# Altium schematic sheet CSWrite3.0.1 V0.51.SchDoc
size 609 x 431 mm; PageSetup: Record=PageOptions|CenterHorizontal=True|CenterVertical=True|PrintScale=0.38|XCorrection=1.00|YCorrection=1.00|PrintKind=2|BorderSize=5000000|LeftOffset=0|BottomOffset=0|Orientation=2|PaperLength=1000|PaperWidth=1000|Scale=100|PaperSource=7|PrintQuality=-4|MediaType=1|DitherType=10|PaperKind=A4|PrintScaleMode=1
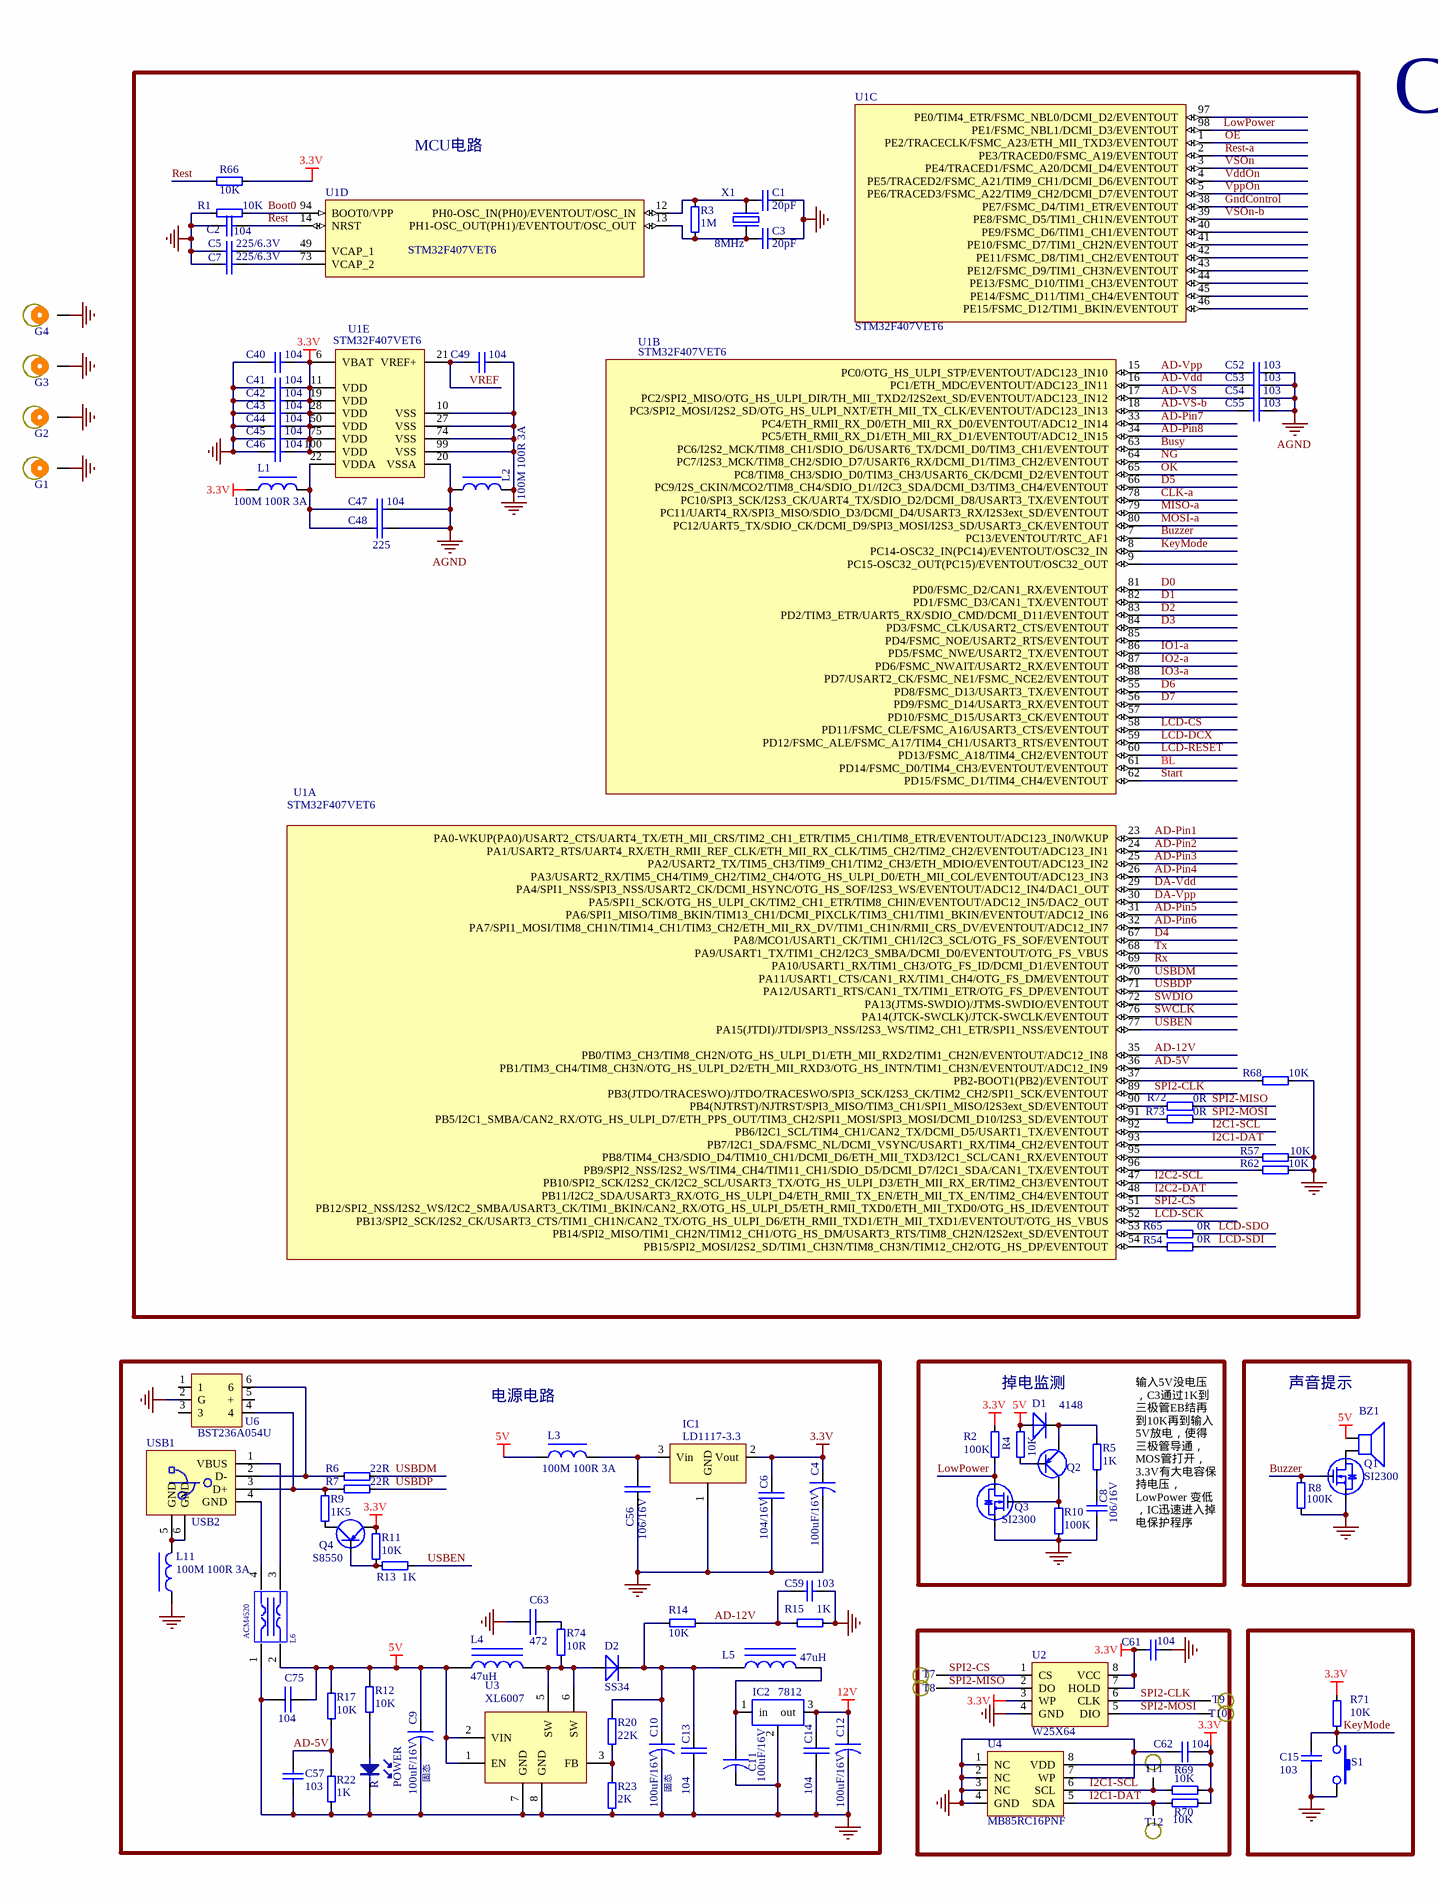
[diagram p0: CSWrite3.0.1 V0.51.SchDoc, left]
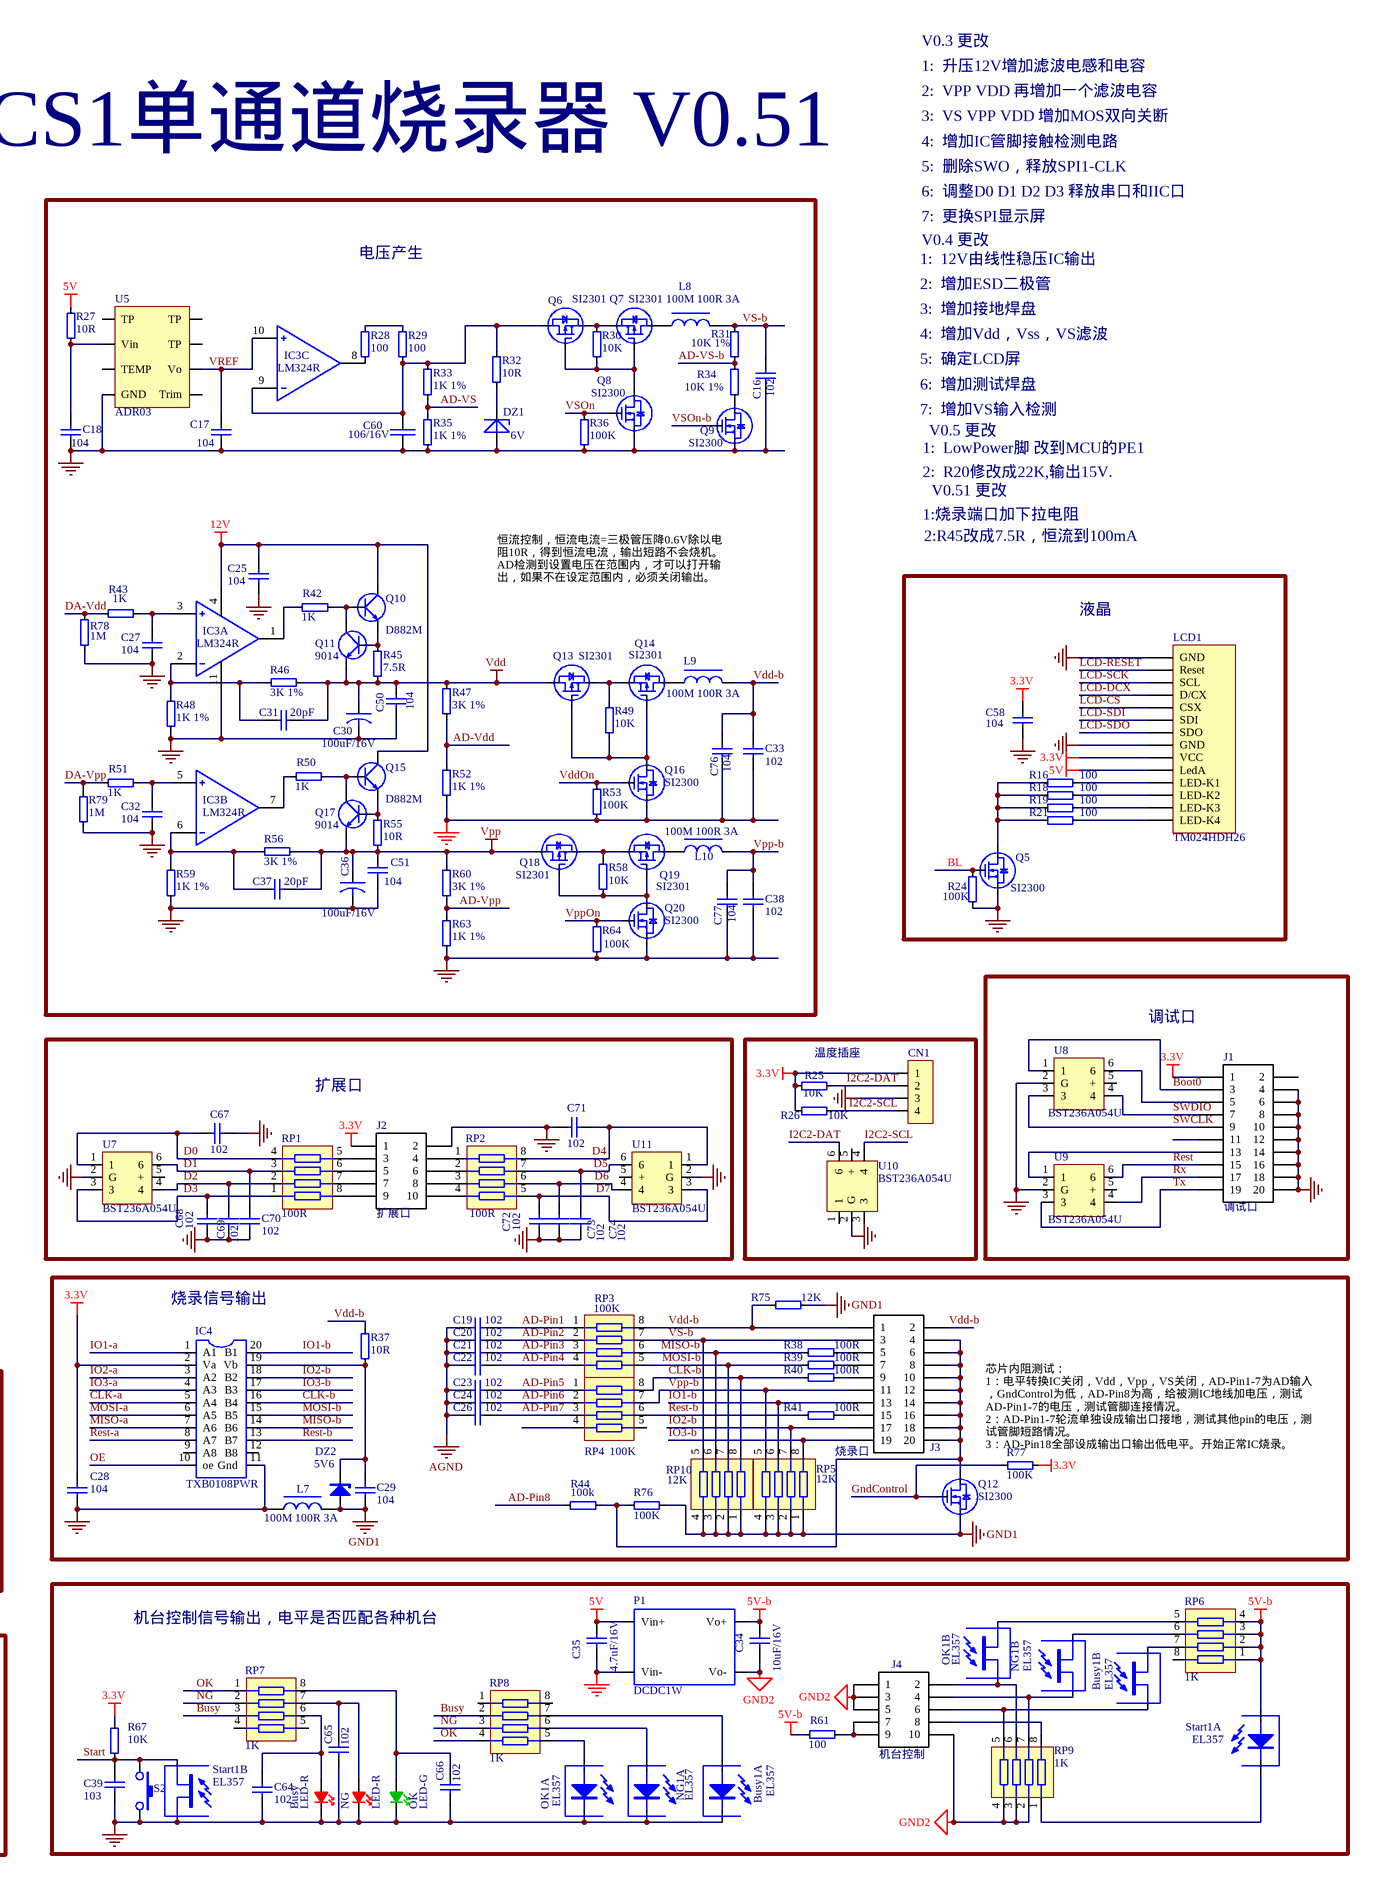
[diagram p1: CSWrite3.0.1 V0.51.SchDoc, right]

## Parts
Busy  LED-R  [LED05]
Busy1  EL357  [SOP-4]  (parts A,B of 2)
BZ1  BUZZER  [FMQ-9*5.5]  (value not drawn)
C1  20pF  [0603C]
C2  104  [0603C]
C3  20pF  [0603C]
C4  100uF/16V  [CAP-B]
C5  225/6.3V  [0603C]
C6  104/16V  [0603C]
C7  225/6.3V  [0603C]
C8  106/16V  [0603C]
C9  100uF/16V  [CB_8*11D5]
C10  100uF/16V  [CB_8*11D5]
C11  100uF/16V  [CB_8*11D5]
C12  100uF/16V  [CB_8*11D5]
C13  104  [0603C]
C14  104  [0603C]
C15  103  [0603C]
C16  102  [0603C]
C17  104  [0603C]
C18  104  [0603C]
C19  102  [0603C]
C20  102  [0603C]
C21  102  [0603C]
C22  102  [0603C]
C23  102  [0603C]
C24  102  [0603C]
C25  104  [0603C]
C26  102  [0603C]
C27  104  [0603C]
C28  104  [0603C]
C29  104  [0603C]
C30  100uF/16V  [CAP-B]
C31  20pF  [0603C]
C32  104  [0603C]
C33  102  [0603C]
C34  10uF/16V  [0603C]
C35  4.7uF/16V  [0603C]
C36  100uF/16V  [CAP-B]
C37  20pF  [0603C]
C38  102  [0603C]
C39  103  [0603C]
C40  104  [0603C]
C41  104  [0603C]
C42  104  [0603C]
C43  104  [0603C]
C44  104  [0603C]
C45  104  [0603C]
C46  104  [0603C]
C47  104  [0603C]
C48  225  [0603C]
C49  104  [0603C]
C50  104  [0603C]
C51  104  [0603C]
C52  103  [0603C]
C53  103  [0603C]
C54  103  [0603C]
C55  103  [0603C]
C56  106/16V  [0603C]
C57  103  [0603C]
C58  104  [0603C]
C59  103  [0603C]
C60  106/16V  [0603C]
C61  104  [0603C]
C62  104  [0603C]
C63  472  [0603C]
C64  102  [0603C]
C65  102  [0603C]
C66  102  [0603C]
C67  102  [0603C]
C68  102  [0603C]
C69  102  [0603C]
C70  102  [0603C]
C71  102  [0603C]
C72  102  [0603C]
C73  102  [0603C]
C74  102  [0603C]
C75  104  [0603C]
C76  104  [0603C]
C77  104  [0603C]
CN1  温度插座  [PH4AW_2D0]
D1  4148  [D1206]
D2  SS34  [D-SMA]
DZ1  6V  [D1206]
DZ2  5V6  [D1206]
G1  GND  [P1]  (value not drawn)
G2  GND  [P1]  (value not drawn)
G3  GND  [P1]  (value not drawn)
G4  GND  [P1]  (value not drawn)
IC1  LD1117-3.3  [SOT223]
IC2  7812  [TO252AA]
IC3  LM324R  [SOP14]  (parts A,B,C of 4)
IC4  TXB0108PWR  [TSSOP20]
J1  调试口  [DC_20P_W]
J2  扩展口  [IDC10-GZ]
J3  烧录口  [IDC20]
J4  机台控制
L1  100M 100R 3A  [0603]
L2  100M 100R 3A  [0603]
L3  100M 100R 3A  [0603]
L4  47uH  [L-SMD6.8*6.8]
L5  47uH  [L-SMD6.8*6.8]
L6  ACM4520  [L_6*7]
L7  100M 100R 3A  [0603]
L8  100M 100R 3A  [0603]
L9  100M 100R 3A  [0603]
L10  100M 100R 3A  [0603]
L11  100M 100R 3A  [0603]
LCD1  TM024HDH26  [TM024HDH26-V02]
NG  LED-R  [LED05]
NG1  EL357  [SOP-4]  (parts A,B of 2)
OK  LED-G  [LED05]
OK1  EL357  [SOP-4]  (parts A,B of 2)
P1  DCDC1W  [1WDC_DC-4]
POWER  R  [LED05]
Q1  SI2300  [SOT-23]
Q2  S8550  [SOT-23]  (value not drawn)
Q3  SI2300  [SOT-23]
Q4  S8550  [SOT23]
Q5  SI2300  [SOT-23]
Q6  SI2301  [SOT23]
Q7  SI2301  [SOT23]
Q8  SI2300  [SOT-23]
Q9  SI2300  [SOT-23]
Q10  D882M  [TO252AA]
Q11  9014  [SOT-23]
Q12  SI2300  [SOT-23]
Q13  SI2301  [SOT23]
Q14  SI2301  [SOT23]
Q15  D882M  [TO252AA]
Q16  SI2300  [SOT-23]
Q17  9014  [SOT-23]
Q18  SI2301  [SOT23]
Q19  SI2301  [SOT23]
Q20  SI2300  [SOT-23]
R1  10K  [0603]
R2  100K  [0603]
R3  1M  [0603]
R4  10K  [0603]
R5  1K  [0603]
R6  22R  [0603]
R7  22R  [0603]
R8  100K  [0603]
R9  1K5  [0603]
R10  100K  [0603]
R11  10K  [0603]
R12  10K  [0603]
R13  1K  [0603]
R14  10K  [0603]
R15  1K  [0603]
R16  100  [0603]
R17  10K  [0603]
R18  100  [0603]
R19  100  [0603]
R20  22K  [0603]
R21  100  [0603]
R22  1K  [0603]
R23  2K  [0603]
R24  100K  [0603]
R25  10K  [0603]
R26  10K  [0603]
R27  10R  [0603]
R28  100  [0603]
R29  100  [0603]
R30  10K  [0603]
R31  10K 1%  [0603]
R32  10R  [0603]
R33  1K 1%  [0603]
R34  10K 1%  [0603]
R35  1K 1%  [0603]
R36  100K  [0603]
R37  10R  [0603]
R38  100R  [0603]
R39  100R  [0603]
R40  100R  [0603]
R41  100R  [0603]
R42  1K  [0603]
R43  1K  [0603]
R44  100k  [0603]
R45  7.5R  [0603]
R46  3K 1%  [0603]
R47  3K 1%  [0603]
R48  1K 1%  [0603]
R49  10K  [0603]
R50  1K  [0603]
R51  1K  [0603]
R52  1K 1%  [0603]
R53  100K  [0603]
R54  0R  [0603]
R55  10R  [0603]
R56  3K 1%  [0603]
R57  10K  [0603]
R58  10K  [0603]
R59  1K 1%  [0603]
R60  3K 1%  [0603]
R61  100  [1206]
R62  10K  [0603]
R63  1K 1%  [0603]
R64  100K  [0603]
R65  0R  [0603]
R66  10K  [0603]
R67  10K  [0603]
R68  10K  [0603]
R69  10K  [0603]
R70  10K  [0603]
R71  10K  [0603]
R72  0R  [0603]
R73  0R  [0603]
R74  10R  [0603]
R75  12K  [0603]
R76  100K  [0603]
R77  100K  [0603]
R78  1M  [0603]
R79  1M  [0603]
RP1  100R  [0603_RX4]
RP2  100R  [0603_RX4]
RP3  100K  [0603_RX4]
RP4  100K  [0603_RX4]
RP5  12K  [0603_RX4]
RP6  1K  [0603_RX4]
RP7  1K  [0603_RX4]
RP8  1K  [0603_RX4]
RP9  1K  [0603_RX4]
RP10  12K  [0603_RX4]
S1  SW-PB  [SW6*6]  (value not drawn)
S2  SW-PB  [SW12*17_PB86]  (value not drawn)
Start1  EL357  [SOP-4]  (parts A,B of 2)
T7  GND  [P2]  (value not drawn)
T8  GND  [P2]  (value not drawn)
T9  GND  [P2]  (value not drawn)
T10  GND  [P2]  (value not drawn)
T11  GND  [P2]  (value not drawn)
T12  GND  [P2]  (value not drawn)
U1  STM32F407VET6  [LQFP100_V]  (parts A,B,C,D,E of 5)
U2  W25X64  [SO-08M]
U3  XL6007  [SO-8]
U4  MB85RC16PNF  [SO-08M]
U5  ADR03  [SOP8]
U6  BST236A054U  [SOT-23-6L]
U7  BST236A054U  [SOT-23-6L]
U8  BST236A054U  [SOT-23-6L]
U9  BST236A054U  [SOT-23-6L]
U10  BST236A054U  [SOT-23-6L]
U11  BST236A054U  [SOT-23-6L]
USB1  USB2  [USB2*2]
X1  8MHz  [ATX5*3.2]

## Blocks framed on the sheet
MCU电路: C1-C3 C5 C7 C40-C49 C52-C55 L1 L2 R1 R3 R54 R57 R62 R65 R66 R68 R72 R73 U1 X1
电压产生: C16-C18 C25 C27 C30-C33 C36-C38 C50 C51 C60 C76 C77 DZ1 IC3 L8-L10 Q6-Q11 Q13-Q20 R27-R36 R42 R43 R45-R53 R55 R56 R58-R60 R63 R64 R78 R79 U5
液晶: C58 LCD1 Q5 R16 R18 R19 R21 R24
调试口: J1 U8 U9
扩展口: C67-C74 J2 RP1 RP2 U7 U11
烧录信号输出: C19-C24 C26 C28 C29 DZ2 IC4 J3 L7 Q12 R37-R41 R44 R75-R77 RP3-RP5 RP10
电源电路: C4 C6 C9-C14 C56 C57 C59 C63 C75 D2 IC1 IC2 L3-L6 L11 POWER Q4 R6 R7 R9 R11-R15 R17 R20 R22 R23 R74 U3 U6 USB1
掉电监测: C8 D1 Q2 Q3 R2 R4 R5 R10
声音提示: BZ1 Q1 R8
机台控制信号输出，电平是否匹配各种机台: Busy Busy1 C34 C35 C39 C64-C66 J4 NG NG1 OK OK1 P1 R61 R67 RP6-RP9 S2 Start1

## Nets
3.3V: C4.1 C6.2 C28.1 C40.1 C41.1 C42.1 C43.1 C44.1 C45.1 C46.1 C58.1 C61.2 C62.1 CN1.1 IC1.2(Vout) IC4.2(Va) J1.1 J2.1 L1.1 LCD1.9(VCC) Q4.3(E) R2.2 R11.1 R25.2 R26.2 R66.2 R67.2 R69.1 R70.1 R71.2 R77.1 U1.6(VBAT) U1.11(VDD) U1.19(VDD) U1.28(VDD) U1.50(VDD) U1.75(VDD) U1.100(VDD) U2.3(WP) U2.7(HOLD) U2.8(VCC) U4.8(VDD)
5V: BZ1.1(+) C9.1 C35.2 C75.1 D1.1(A) L3.1 L4.1 L6.2 LCD1.10(LedA) P1.1(Vin+) R4.2 R12.2 R17.1 R27.2 U3.1(EN) U3.2(VIN)
5V-b: C34.2 P1.4(Vo+) R61.2 RP6.1 RP6.2 RP6.3 RP6.4 Start1.1(A)
12V: C12.1 C14.2 C25.2 IC2.3(out) IC3.4 Q10.2(C) Q15.2(C)
AGND: C19.1 C20.1 C21.1 C22.1 C23.1 C24.1 C26.1 C47.2 C48.2 C52.1 C53.1 C54.1 C55.1 L2.1 U1.20(VSSA)
GND: Busy.2 Busy1.2(K) C1.1 C2.1 C3.1 C4.2 C5.1 C6.1 C7.1 C8.1 C9.2 C10.2 C11.2 C12.2 C13.1 C14.1 C15.2 C16.2 C17.1 C18.1 C25.1 C27.1 C28.2 C30.2 C32.1 C33.1 C35.1 C36.2 C38.1 C39.2 C40.2 C41.2 C42.2 C43.2 C44.2 C45.2 C46.2 C49.1 C50.1 C51.1 C56.1 C57.2 C58.2 C59.2 C60.1 C61.1 C62.2 C63.2 C64.1 C65.1 C66.1 C67.1 C68.1 C69.1 C70.1 C71.2 C72.1 C73.1 C74.1 C75.2 C76.2 C77.2 CN1.3 DZ1.1(A) G1.1 G2.1 G3.1 G4.1 IC1.1(GND) IC2.2 IC3.11 IC4.11(Gnd) J1.4 J1.6 J1.8 J1.10 J1.12 J1.14 J1.16 J1.18 J1.20 J2.2 L2.2 L6.1 L7.1 L11.1 LCD1.1(GND) LCD1.8(GND) NG.2 NG1.2(K) OK.2 OK1.2(K) P1.2(Vin-) POWER.2(K) Q1.3(S) Q3.3(S) Q5.3(S) Q8.3(S) Q9.3(S) Q16.3(S) Q20.3(S) R1.1 R8.2 R10.1 R15.2 R22.2 R23.2 R24.2 R35.2 R36.1 R48.1 R52.2 R53.1 R57.1 R59.1 R62.1 R63.2 R64.1 R68.1 R78.1 R79.1 S1.1 S2.1 Start1.4(C) U1.10(VSS) U1.27(VSS) U1.74(VSS) U1.99(VSS) U2.4(GND) U3.7(GND) U3.8(GND) U4.1(NC) U4.2(NC) U4.3(NC) U4.4(GND) U4.7(WP) U5.4(GND) U6.2(G) U7.2(G) U8.2(G) U9.2(G) U10.2(G) U11.2(G)
GND1: C29.2 DZ2.1(A) L7.2 Q12.3(S) R75.2 R76.1 RP5.1 RP5.2 RP5.3 RP5.4 RP10.1 RP10.2 RP10.3 RP10.4
GND2: C34.1 J4.1 J4.3 J4.5 J4.10 P1.3(Vo-) RP9.2 RP9.3 RP9.4
Vdd: C30.1 C31.2 C50.2 Q11.3(E) Q13.2(D) R45.2 R46.2 R47.1
Vpp: C36.1 C37.2 C51.2 Q17.3(E) Q18.2(D) R55.2 R56.2 R60.1
AD-5V: C57.1 R17.2 R22.1 U1.36(PB1/TIM3_CH4/TIM8_CH3N/OTG_HS_ULPI_D2/ETH_MII_RXD3/OTG_HS_INTN/TIM1_CH3N/EVENTOUT/ADC12_IN9)
AD-12V: C59.1 R14.2 R15.1 U1.35(PB0/TIM3_CH3/TIM8_CH2N/OTG_HS_ULPI_D1/ETH_MII_RXD2/TIM1_CH2N/EVENTOUT/ADC12_IN8)
AD-Pin1: C19.2 RP3.1 U1.23(PA0-WKUP(PA0)/USART2_CTS/UART4_TX/ETH_MII_CRS/TIM2_CH1_ETR/TIM5_CH1/TIM8_ETR/EVENTOUT/ADC123_IN0/WKUP)
AD-Pin2: C20.2 RP3.2 U1.24(PA1/USART2_RTS/UART4_RX/ETH_RMII_REF_CLK/ETH_MII_RX_CLK/TIM5_CH2/TIM2_CH2/EVENTOUT/ADC123_IN1)
AD-Pin3: C21.2 RP3.3 U1.25(PA2/USART2_TX/TIM5_CH3/TIM9_CH1/TIM2_CH3/ETH_MDIO/EVENTOUT/ADC123_IN2)
AD-Pin4: C22.2 RP3.4 U1.26(PA3/USART2_RX/TIM5_CH4/TIM9_CH2/TIM2_CH4/OTG_HS_ULPI_D0/ETH_MII_COL/EVENTOUT/ADC123_IN3)
AD-Pin5: C23.2 RP4.1 U1.31(PA6/SPI1_MISO/TIM8_BKIN/TIM13_CH1/DCMI_PIXCLK/TIM3_CH1/TIM1_BKIN/EVENTOUT/ADC12_IN6)
AD-Pin6: C24.2 RP4.2 U1.32(PA7/SPI1_MOSI/TIM8_CH1N/TIM14_CH1/TIM3_CH2/ETH_MII_RX_DV/TIM1_CH1N/RMII_CRS_DV/EVENTOUT/ADC12_IN7)
AD-Pin7: C26.2 RP4.3 U1.33(PC4/ETH_RMII_RX_D0/ETH_MII_RX_D0/EVENTOUT/ADC12_IN14)
AD-Pin8: R44.1 U1.34(PC5/ETH_RMII_RX_D1/ETH_MII_RX_D1/EVENTOUT/ADC12_IN15)
AD-Vdd: C53.2 R47.2 R52.1 U1.16(PC1/ETH_MDC/EVENTOUT/ADC123_IN11)
AD-Vpp: C52.2 R60.2 R63.1 U1.15(PC0/OTG_HS_ULPI_STP/EVENTOUT/ADC123_IN10)
AD-VS: C54.2 R33.2 R35.1 U1.17(PC2/SPI2_MISO/OTG_HS_ULPI_DIR/TH_MII_TXD2/I2S2ext_SD/EVENTOUT/ADC123_IN12)
AD-VS-b: C55.2 R31.2 R34.1 U1.18(PC3/SPI2_MOSI/I2S2_SD/OTG_HS_ULPI_NXT/ETH_MII_TX_CLK/EVENTOUT/ADC123_IN13)
BL: Q5.1(G) R24.1 U1.61(PD14/FSMC_D0/TIM4_CH3/EVENTOUT/EVENTOUT)
Boot0: J1.3 R1.2 U1.94(BOOT0/VPP) U8.1
Busy: RP7.3 RP8.2 U1.63(PC6/I2S2_MCK/TIM8_CH1/SDIO_D6/USART6_TX/DCMI_D0/TIM3_CH1/EVENTOUT)
Buzzer: Q1.1(G) R8.1 U1.7(PC13/EVENTOUT/RTC_AF1)
CLK-a: IC4.5(A4) U1.78(PC10/SPI3_SCK/I2S3_CK/UART4_TX/SDIO_D2/DCMI_D8/USART3_TX/EVENTOUT)
CLK-b: IC4.16(B4) R40.1 RP4.8 RP10.8
D0: C67.2 RP1.4 U1.81(PD0/FSMC_D2/CAN1_RX/EVENTOUT) U7.1
D1: C70.2 RP1.3 U1.82(PD1/FSMC_D3/CAN1_TX/EVENTOUT) U7.6
D2: C69.2 RP1.2 U1.83(PD2/TIM3_ETR/UART5_RX/SDIO_CMD/DCMI_D11/EVENTOUT) U7.4
D3: C68.2 RP1.1 U1.84(PD3/FSMC_CLK/USART2_CTS/EVENTOUT) U7.3
D4: C71.1 RP2.8 U1.67(PA8/MCO1/USART1_CK/TIM1_CH1/I2C3_SCL/OTG_FS_SOF/EVENTOUT) U11.1
D5: C74.2 RP2.7 U1.66(PC9/I2S_CKIN/MCO2/TIM8_CH4/SDIO_D1//I2C3_SDA/DCMI_D3/TIM3_CH4/EVENTOUT) U11.6
D6: C73.2 RP2.6 U1.55(PD8/FSMC_D13/USART3_TX/EVENTOUT) U11.4
D7: C72.2 RP2.5 U1.56(PD9/FSMC_D14/USART3_RX/EVENTOUT) U11.3
DA-Vdd: R43.1 R78.2 U1.29(PA4/SPI1_NSS/SPI3_NSS/USART2_CK/DCMI_HSYNC/OTG_HS_SOF/I2S3_WS/EVENTOUT/ADC12_IN4/DAC1_OUT)
DA-Vpp: R51.1 R79.2 U1.30(PA5/SPI1_SCK/OTG_HS_ULPI_CK/TIM2_CH1_ETR/TIM8_CHIN/EVENTOUT/ADC12_IN5/DAC2_OUT)
GndControl: Q12.1(G) R77.2 U1.38(PE7/FSMC_D4/TIM1_ETR/EVENTOUT)
I2C1-DAT: R70.2 T12.1 U1.93(PB7/I2C1_SDA/FSMC_NL/DCMI_VSYNC/USART1_RX/TIM4_CH2/EVENTOUT) U4.5(SDA)
I2C1-SCL: R69.2 T11.1 U1.92(PB6/I2C1_SCL/TIM4_CH1/CAN2_TX/DCMI_D5/USART1_TX/EVENTOUT) U4.6(SCL)
I2C2-DAT: CN1.2 R25.1 U1.48(PB11/I2C2_SDA/USART3_RX/OTG_HS_ULPI_D4/ETH_RMII_TX_EN/ETH_MII_TX_EN/TIM2_CH4/EVENTOUT) U10.6
I2C2-SCL: CN1.4 R26.1 U1.47(PB10/SPI2_SCK/I2S2_CK/I2C2_SCL/USART3_TX/OTG_HS_ULPI_D3/ETH_MII_RX_ER/TIM2_CH3/EVENTOUT) U10.4
IO1-a: IC4.1(A1) U1.86(PD5/FSMC_NWE/USART2_TX/EVENTOUT)
IO1-b: IC4.20(B1) J3.13 RP5.6
IO2-a: IC4.3(A2) U1.87(PD6/FSMC_NWAIT/USART2_RX/EVENTOUT)
IO2-b: IC4.18(B2) J3.17 RP5.7
IO3-a: IC4.4(A3) U1.88(PD7/USART2_CK/FSMC_NE1/FSMC_NCE2/EVENTOUT)
IO3-b: IC4.17(B3) J3.19 RP5.8
KeyMode: C15.1 R71.1 S1.2 U1.8(PC14-OSC32_IN(PC14)/EVENTOUT/OSC32_IN)
LCD-CS: LCD1.5(CSX) U1.58(PD11/FSMC_CLE/FSMC_A16/USART3_CTS/EVENTOUT)
LCD-DCX: LCD1.4(D/CX) U1.59(PD12/FSMC_ALE/FSMC_A17/TIM4_CH1/USART3_RTS/EVENTOUT)
LCD-RESET: LCD1.2(Reset) U1.60(PD13/FSMC_A18/TIM4_CH2/EVENTOUT)
LCD-SCK: LCD1.3(SCL) U1.52(PB13/SPI2_SCK/I2S2_CK/USART3_CTS/TIM1_CH1N/CAN2_TX/OTG_HS_ULPI_D6/ETH_RMII_TXD1/ETH_MII_TXD1/EVENTOUT/OTG_HS_VBUS)
LCD-SDI: LCD1.6(SDI) R54.1
LCD-SDO: LCD1.7(SDO) R65.1
LowPower: Q3.2(D) R2.1 U1.98(PE1/FSMC_NBL1/DCMI_D3/EVENTOUT)
MISO-a: IC4.7(A6) U1.79(PC11/UART4_RX/SPI3_MISO/SDIO_D3/DCMI_D4/USART3_RX/I2S3ext_SD/EVENTOUT)
MISO-b: IC4.14(B6) R38.1 RP3.6 RP10.6
MOSI-a: IC4.6(A5) U1.80(PC12/UART5_TX/SDIO_CK/DCMI_D9/SPI3_MOSI/I2S3_SD/USART3_CK/EVENTOUT)
MOSI-b: IC4.15(B5) R39.1 RP3.5 RP10.7
NG: RP7.2 RP8.3 U1.64(PC7/I2S3_MCK/TIM8_CH2/SDIO_D7/USART6_RX/DCMI_D1/TIM3_CH2/EVENTOUT)
OE: IC4.10(oe) U1.1(PE2/TRACECLK/FSMC_A23/ETH_MII_TXD3/EVENTOUT)
OK: RP7.1 RP8.4 U1.65(PC8/TIM8_CH3/SDIO_D0/TIM3_CH3/USART6_CK/DCMI_D2/EVENTOUT)
Rest: C2.2 J1.15 R66.1 U1.14(NRST) U9.6
Rest-a: IC4.8(A7) U1.2(PE3/TRACED0/FSMC_A19/EVENTOUT)
Rest-b: IC4.13(B7) R41.1 RP4.6
Rx: J1.17 U1.69(PA10/USART1_RX/TIM1_CH3/OTG_FS_ID/DCMI_D1/EVENTOUT) U9.4
SPI2-CLK: T9.1 U1.89(PB3(JTDO/TRACESWO)/JTDO/TRACESWO/SPI3_SCK/I2S3_CK/TIM2_CH2/SPI1_SCK/EVENTOUT) U2.6(CLK)
SPI2-CS: T7.1 U1.51(PB12/SPI2_NSS/I2S2_WS/I2C2_SMBA/USART3_CK/TIM1_BKIN/CAN2_RX/OTG_HS_ULPI_D5/ETH_RMII_TXD0/ETH_MII_TXD0/OTG_HS_ID/EVENTOUT) U2.1(CS)
SPI2-MISO: R72.1 T8.1 U2.2(DO)
SPI2-MOSI: R73.1 T10.1 U2.5(DIO)
Start: C39.1 R67.1 S2.2 Start1.3(E) U1.62(PD15/FSMC_D1/TIM4_CH4/EVENTOUT)
SWCLK: J1.9 U1.76(PA14(JTCK-SWCLK)/JTCK-SWCLK/EVENTOUT) U8.3
SWDIO: J1.7 U1.72(PA13(JTMS-SWDIO)/JTMS-SWDIO/EVENTOUT) U8.4
Tx: J1.19 U1.68(PA9/USART1_TX/TIM1_CH2/I2C3_SMBA/DCMI_D0/EVENTOUT/OTG_FS_VBUS) U9.3
USBDM: R7.1 U1.70(PA11/USART1_CTS/CAN1_RX/TIM1_CH4/OTG_FS_DM/EVENTOUT)
USBDP: R6.1 U1.71(PA12/USART1_RTS/CAN1_TX/TIM1_ETR/OTG_FS_DP/EVENTOUT)
USBEN: R13.2 U1.77(PA15(JTDI)/JTDI/SPI3_NSS/I2S3_WS/TIM2_CH1_ETR/SPI1_NSS/EVENTOUT)
Vdd-b: C33.2 C76.1 J3.1 J3.2 L9.2 R37.1 R75.1 RP3.8
VddOn: Q16.1(G) R53.2 U1.4(PE5/TRACED2/FSMC_A21/TIM9_CH1/DCMI_D6/EVENTOUT)
Vpp-b: C38.2 C77.1 J3.11 L10.2 RP4.7 RP5.5
VppOn: Q20.1(G) R64.2 U1.5(PE6/TRACED3/FSMC_A22/TIM9_CH2/DCMI_D7/EVENTOUT)
VREF: C17.2 C49.2 IC3.10 U1.21(VREF+) U5.6(Vo)
VS-b: C16.1 J3.3 L8.2 R31.1 RP3.7 RP10.5
VSOn: Q8.1(G) R36.2 U1.3(PE4/TRACED1/FSMC_A20/DCMI_D4/EVENTOUT)
VSOn-b: Q9.1(G) U1.39(PE8/FSMC_D5/TIM1_CH1N/EVENTOUT)
NetBusy1_1: Busy1.1(A) RP8.7
NetBusy1_3: Busy1.3(E) J4.6 RP9.5
NetBusy1_4: Busy1.4(C) RP6.7
NetBusy_1: Busy.1 C64.2 RP7.6
NetBZ1_2: BZ1.2(-) Q1.2(D)
NetC1_2: C1.2 R3.2 U1.12(PH0-OSC_IN(PH0)/EVENTOUT/OSC_IN) X1.2
NetC3_2: C3.2 R3.1 U1.13(PH1-OSC_OUT(PH1)/EVENTOUT/OSC_OUT) X1.1
NetC5_2: C5.2 U1.49(VCAP_1)
NetC7_2: C7.2 U1.73(VCAP_2)
NetC8_2: C8.2 R5.1
NetC10_1: C10.1 C13.2 D2.2(K) L5.1 R14.1 R20.1
NetC11_1: C11.1 IC2.1(in) L5.2
NetC18_2: C18.2 R27.1 U5.2(Vin)
NetC27_2: C27.2 IC3.3 R43.2
NetC29_1: C29.1 DZ2.2(K) IC4.19(Vb) R37.2
NetC31_1: C31.1 IC3.2 R46.1 R48.2
NetC32_2: C32.2 IC3.5 R51.2
NetC37_1: C37.1 IC3.6 R56.1 R59.2
NetC47_1: C47.1 C48.1 L1.2 U1.22(VDDA)
NetC56_2: C56.2 IC1.3(Vin) L3.2
NetC60_2: C60.2 IC3.9 Q6.2(D) R29.1 R32.1 R33.1
NetC63_1: C63.1 R74.1
NetC65_2: C65.2 NG.1 RP7.7
NetC66_2: C66.2 OK.1 RP7.8
NetD1_2: D1.2(K) Q2.3(E) R5.2
NetD2_1: D2.1(A) L4.2 R74.2 U3.5(SW) U3.6(SW)
NetDZ1_2: DZ1.2(K) R32.2
NetIC3_1: IC3.1 R42.1
NetIC3_7: IC3.7 R50.1
NetIC3_8: IC3.8 R28.1
NetJ1_5: J1.5 U8.6
NetJ1_13: J1.13 U9.1
NetJ2_3: J2.3 RP1.5
NetJ2_4: J2.4 RP2.1
NetJ2_5: J2.5 RP1.6
NetJ2_6: J2.6 RP2.2
NetJ2_7: J2.7 RP1.7
NetJ2_8: J2.8 RP2.3
NetJ2_9: J2.9 RP1.8
NetJ2_10: J2.10 RP2.4
NetJ3_4: J3.4 J3.6 J3.8 J3.10 J3.12 J3.14 J3.16 J3.18 J3.20 Q12.2(D) R44.2 R76.2
NetJ3_5: J3.5 R38.2
NetJ3_7: J3.7 R39.2
NetJ3_9: J3.9 R40.2
NetJ3_15: J3.15 R41.2
NetJ4_2: J4.2 OK1.3(E) RP9.6
NetJ4_4: J4.4 NG1.3(E) RP9.7
NetJ4_7: J4.7 J4.9 R61.1
NetJ4_8: J4.8 RP9.8
NetL6_3: L6.3 USB1.1(VBUS)
NetL6_4: L6.4 USB1.4(GND)
NetL8_1: L8.1 Q7.2(D)
NetL9_1: L9.1 Q14.2(D)
NetL10_1: L10.1 Q19.2(D)
NetL11_2: L11.2 USB1.5(GND) USB1.6(GND)
NetLCD1_11: LCD1.11(LED-K1) R16.2
NetLCD1_12: LCD1.12(LED-K2) R18.2
NetLCD1_13: LCD1.13(LED-K3) R19.2
NetLCD1_14: LCD1.14(LED-K4) R21.2
NetNG1_1: NG1.1(A) RP8.6
NetNG1_4: NG1.4(C) RP6.6
NetOK1_1: OK1.1(A) RP8.5
NetOK1_4: OK1.4(C) RP6.5
NetPOWER_1: POWER.1(A) R12.1
NetQ2_1: Q2.1(B) R4.1
NetQ2_2: Q2.2(C) Q3.1(G) R10.2
NetQ4_1: Q4.1(B) R11.2 R13.1
NetQ4_2: Q4.2(C) R9.2
NetQ5_2: Q5.2(D) R16.1 R18.1 R19.1 R21.1
NetQ6_1: Q6.1(G) Q7.1(G) Q8.2(D) R30.1
NetQ6_3: Q6.3(S) Q7.3(S) R30.2
NetQ9_2: Q9.2(D) R34.2
NetQ10_1: Q10.1(B) Q11.2(C) R42.2
NetQ10_3: Q10.3(E) Q11.1(B) R45.1
NetQ13_1: Q13.1(G) Q14.1(G) Q16.2(D) R49.1
NetQ13_3: Q13.3(S) Q14.3(S) R49.2
NetQ15_1: Q15.1(B) Q17.2(C) R50.2
NetQ15_3: Q15.3(E) Q17.1(B) R55.1
NetQ18_1: Q18.1(G) Q19.1(G) Q20.2(D) R58.1
NetQ18_3: Q18.3(S) Q19.3(S) R58.2
NetR6_2: R6.2 R9.1 U6.4 USB1.3(D+)
NetR7_2: R7.2 U6.6 USB1.2(D-)
NetR20_2: R20.2 R23.1 U3.3(FB)
NetR28_2: R28.2 R29.2
NetR54_2: R54.2 U1.54(PB15/SPI2_MOSI/I2S2_SD/TIM1_CH3N/TIM8_CH3N/TIM12_CH2/OTG_HS_DP/EVENTOUT)
NetR57_2: R57.2 U1.95(PB8/TIM4_CH3/SDIO_D4/TIM10_CH1/DCMI_D6/ETH_MII_TXD3/I2C1_SCL/CAN1_RX/EVENTOUT)
NetR62_2: R62.2 U1.96(PB9/SPI2_NSS/I2S2_WS/TIM4_CH4/TIM11_CH1/SDIO_D5/DCMI_D7/I2C1_SDA/CAN1_TX/EVENTOUT)
NetR65_2: R65.2 U1.53(PB14/SPI2_MISO/TIM1_CH2N/TIM12_CH1/OTG_HS_DM/USART3_RTS/TIM8_CH2N/I2S2ext_SD/EVENTOUT)
NetR68_2: R68.2 U1.37(PB2-BOOT1(PB2)/EVENTOUT)
NetR72_2: R72.2 U1.90(PB4(NJTRST)/NJTRST/SPI3_MISO/TIM3_CH1/SPI1_MISO/I2S3ext_SD/EVENTOUT)
NetR73_2: R73.2 U1.91(PB5/I2C1_SMBA/CAN2_RX/OTG_HS_ULPI_D7/ETH_PPS_OUT/TIM3_CH2/SPI1_MOSI/SPI3_MOSI/DCMI_D10/I2S3_SD/EVENTOUT)
NetRP9_1: RP9.1 Start1.2(K)

Not connected (* = marked no-connect by the designer): IC4 9(A8) 12(B8); J1 2 11; RP4 4 5; RP6 8; RP7 4 5; RP8 1 8; U1 9(PC15-OSC32_OUT(PC15)/EVENTOUT/OSC32_OUT) 40(PE9/FSMC_D6/TIM1_CH1/EVENTOUT) 41(PE10/FSMC_D7/TIM1_CH2N/EVENTOUT) 42(PE11/FSMC_D8/TIM1_CH2/EVENTOUT) 43(PE12/FSMC_D9/TIM1_CH3N/EVENTOUT) 44(PE13/FSMC_D10/TIM1_CH3/EVENTOUT) 45(PE14/FSMC_D11/TIM1_CH4/EVENTOUT) 46(PE15/FSMC_D12/TIM1_BKIN/EVENTOUT) 57(PD10/FSMC_D15/USART3_CK/EVENTOUT) 85(PD4/FSMC_NOE/USART2_RTS/EVENTOUT) 97(PE0/TIM4_ETR/FSMC_NBL0/DCMI_D2/EVENTOUT); U5 1(TP) 3(TEMP) 5(Trim) 7(TP) 8(TP); U6 1 3 5(+); U7 5(+); U8 5(+); U9 5(+); U10 1 3 5(+); U11 5(+)

## Notes on the sheet
- V0.3 更改
- 1:  升压12V增加滤波电感和电容
- 2:  VPP VDD 再增加一个滤波电容
- 3:  VS VPP VDD 增加MOS双向关断
- CS1单通道烧录器 V0.51
- 4:  增加IC管脚接触检测电路
- 5:  删除SWO，释放SPI1-CLK
- 6:  调整D0 D1 D2 D3 释放串口和IIC口
- 7:  更换SPI显示屏
- V0.4 更改
- 1:  12V由线性稳压IC输出
- 2:  增加ESD二极管
- 3:  增加接地焊盘
- 4:  增加Vdd，Vss，VS滤波
- 5:  确定LCD屏
- 6:  增加测试焊盘
- 7:  增加VS输入检测
- V0.5 更改
- 1:  LowPower脚 改到MCU的PE1
- 2:  R20修改成22K,输出15V.
- V0.51 更改
- 1:烧录端口加下拉电阻
- 2:R45改成7.5R，恒流到100mA
- 恒流控制，恒流电流=三极管压降0.6V除以电阻10R，得到恒流电流，输出短路不会烧机。AD检测到设置电压在范围内，才可以打开输出，如果不在设定范围内，必须关闭输出。
- (near R77) 芯片内阻测试：
  1：电平转换IC关闭，Vdd，Vpp，VS关闭，AD-Pin1-7为AD输入，GndControl为低，AD-Pin8为高，给被测IC地线加电压，测试AD-Pin1-7的电压，测试管脚连接情况。
  2：AD-Pin1-7轮流单独设成输出口接地，测试其他pin的电压，测试管脚短路情况。
  3：AD-Pin18全部设成输出口输出低电平。开始正常IC烧录。
- 输入5V没电压，C3通过1K到三极管EB结再到10K再到输入5V放电，使得三极管导通，MOS管打开，3.3V有大电容保持电压，LowPower 变低，IC迅速进入掉电保护程序
- (near C9) 固态
- 固态

## Library data of the parts
Busy NG = LEDR
Busy1 NG1 OK1 Start1 = MOS光耦
BZ1 = Speaker
C1-C3 C5-C8 C13-C29 C31-C35 C37-C77 = CAP: 无极电容
C4 C9-C12 C30 C36 = CAPACITOR
CN1 = CON4: 接插件
D1 D2 = D: 二极管
DZ1 = DZ_s: 贴片稳压管
DZ2 = DZ: 稳压二极管
G1-G4 T7-T12 = J1
IC1 = LM1117
IC2 = 7805: 三端稳压
IC3 = LM324: 运放IC
IC4 = IC20Pin
J1 J3 = Con10x2
J2 J4 = Con5x2
L1-L3 L7-L11 = L1
L4 L5 = INDUCTOR IRON
L6 = ACP3225: PCB DECAL: COIL_ACM4520; Comment_1: ACP3225
LCD1 = SIP14: jointbar
OK = LEDG
P1 = 1WDC_DC
POWER = LED-B
Q1 Q3 Q5 Q8 Q9 Q12 Q16 Q20 = MOSFET N: 场效应管
Q2 Q4 = PNP1: 三极管
Q6 Q7 Q13 Q14 Q18 Q19 = PMOS: 场效应管
Q10 Q11 Q15 Q17 = NPN1: 三极管
R1-R19 R21 R22 R24-R73 R75-R79 = R: 电阻
R20 R23 R74 = RES: 电阻
RP1-RP10 = RP-4
U1 = STM32F407VET6: ARM Cortex-M4 32b MCU+FPU, 210DMIP, 512 kB Flash, 192+4 kB RAM, Camera, 82 I/Os, 100-pin LQFP, -40 to +85癈, Tray; Internal RAM: 192kB; Operating Frequency (Processor Speed): 168MHz; A/D Converter: 16x12-bit; D/A Converter: 2x12-bit; 16-bit Timers (IC/OC/PWM): 12x16-bit(24/24/30); 32-bit Timer (IC/OC/PWM): 2x32-bit (8/8/8); Other Timer Functions: 2xWDG, RTC, 24-bit down counter; Serial Interface: 3xSPI/2xI2S/2xI2C/3xUSART(IrDa, ISO7816)/3xUART/2xUSB OTG FS/HS, 2xCAN/Ethernet MAC10/100, SDIO; DatasheetVersion: rev2, Jan-2012; PackageVersion: 2012; PackageReference: LQFP100; PackageDescription: 100-Pin Low Profile Quad Flat Package, 14x14 mm Body, 0.5 mm Pitch; ComponentLink1Description: Manufacturer URL; ComponentLink1URL: http://www.st.com/; ComponentLink2Description: STM32F405/7 Datasheet; ComponentLink2URL: http://www.st.com/internet/com/TECHNICAL_RESOURCES/TECHNICAL_LITERATURE/DATASHEET/DM00037051.pdf; ComponentLink3Description: STM32F4 Web Page; ComponentLink3URL: http://www.st.com/internet/mcu/subclass/1521.jsp
U2 U4 = W25X16
U3 = XL4007
U5 = AD680AR
U6-U11 = 6PIN
X1 = ATX: 晶体振荡器